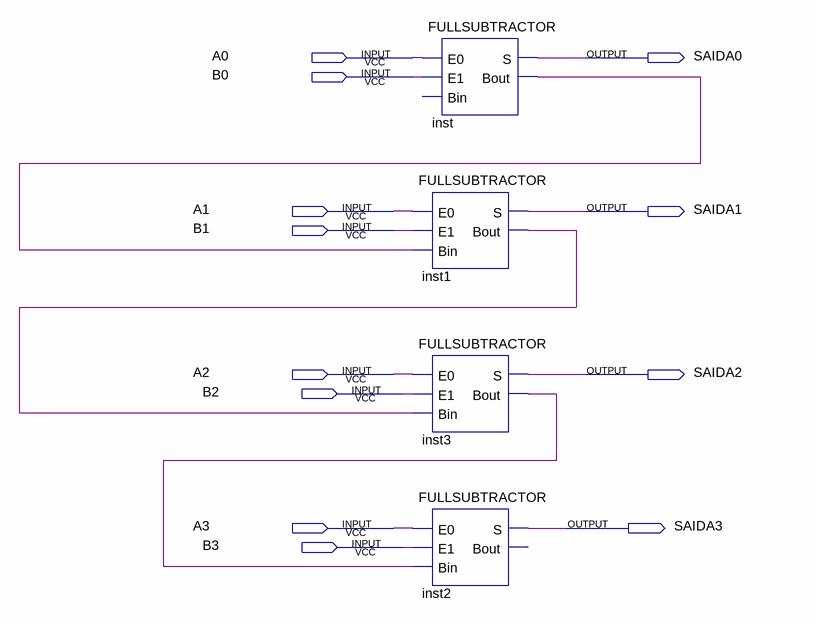
[diagram p0: schematic sheet]
// Quartus schematic sub.bdf as structural Verilog: 4 symbols, 12 pins
module sub (
  input  A0,
  input  B0,
  input  A1,
  input  B1,
  input  A2,
  input  B2,
  input  A3,
  input  B3,
  output SAIDA0,
  output SAIDA1,
  output SAIDA2,
  output SAIDA3
);

  wire inst1_bout, inst3_bout, inst_bout;

  FULLSUBTRACTOR inst1 (.E0(A1), .E1(B1), .Bin(inst_bout), .S(SAIDA1), .Bout(inst1_bout));
  FULLSUBTRACTOR inst3 (.E0(A2), .E1(B2), .Bin(inst1_bout), .S(SAIDA2), .Bout(inst3_bout));
  FULLSUBTRACTOR inst2 (.E0(A3), .E1(B3), .Bin(inst3_bout), .S(SAIDA3));  // open: Bout
  FULLSUBTRACTOR inst (.E0(A0), .E1(B0), .S(SAIDA0), .Bout(inst_bout));  // open: Bin
endmodule
